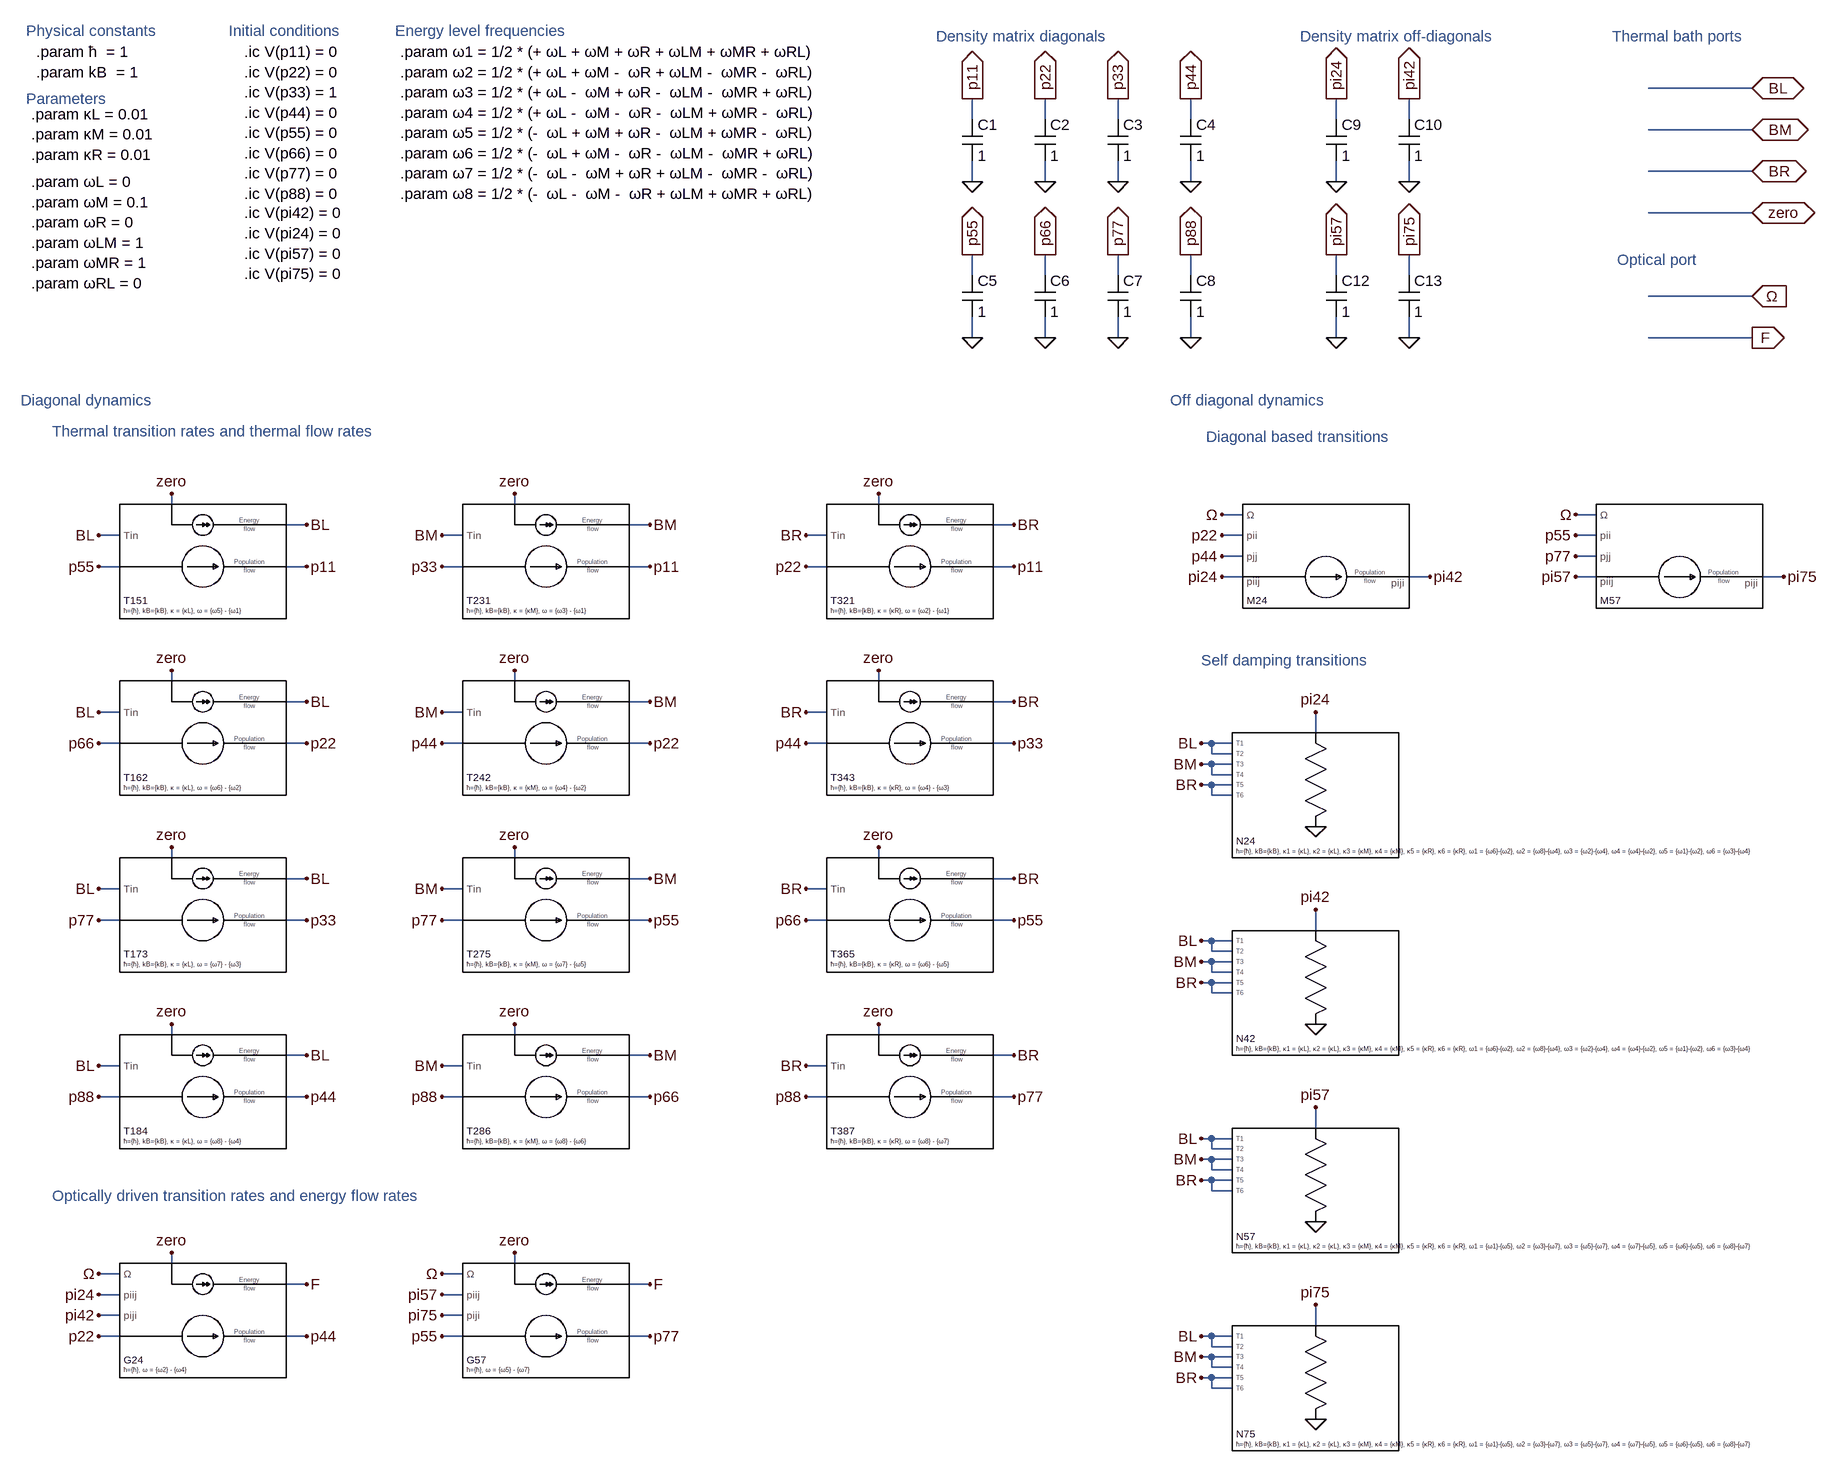
[diagram p0: schematic thermal_optical_gate_Wije.asc]
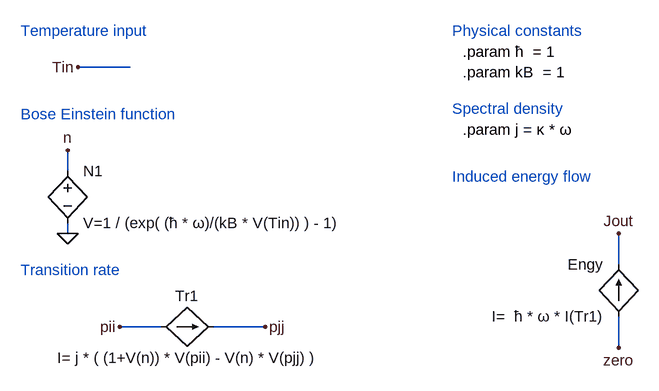
[diagram p1: sub-circuit transition_rate.asc]
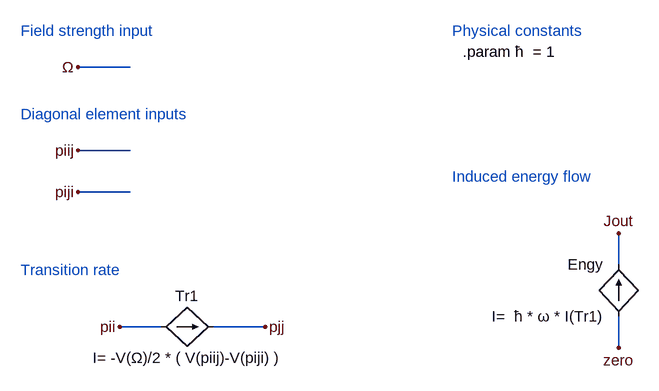
[diagram p2: sub-circuit driven_rate_diag.asc]
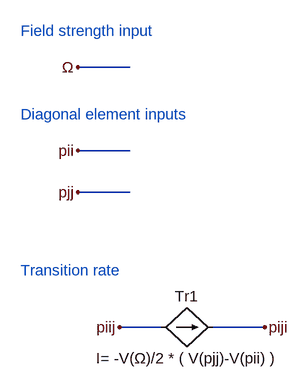
[diagram p3: sub-circuit driven_rate_ofdiag.asc]
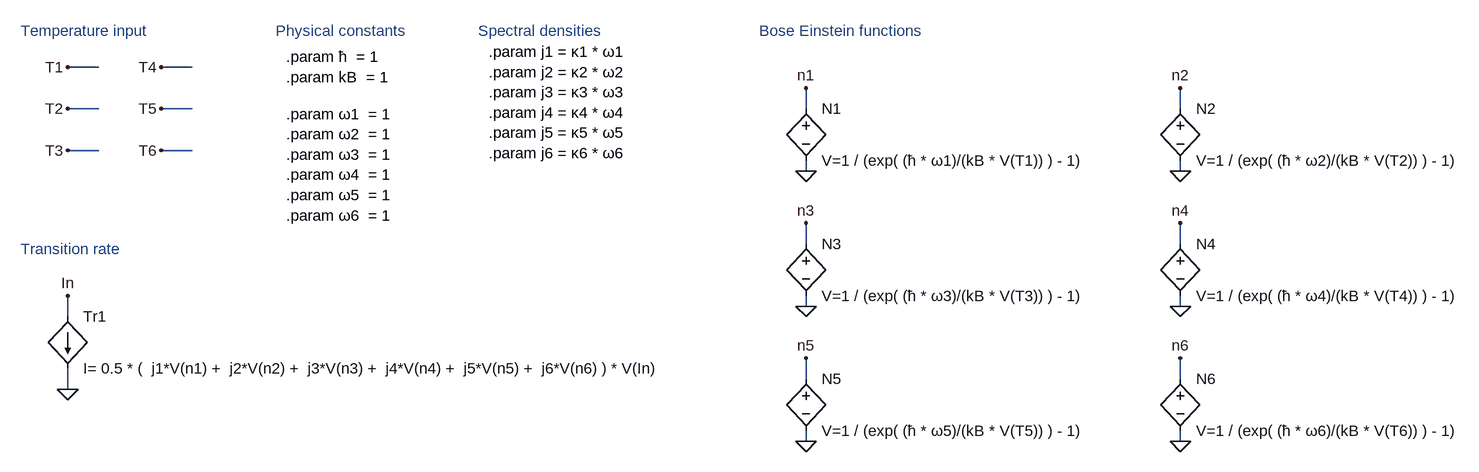
[diagram p4: sub-circuit self_damping_rate.asc]
thermal_optical_gate_Wije.asc, the LTspice schematic file:
Version 4
SHEET 1 2824 2404
WIRE 1968 96 1808 96
WIRE 768 144 768 112
WIRE 880 144 880 112
WIRE 992 144 992 112
WIRE 1104 144 1104 112
WIRE 1328 144 1328 112
WIRE 1440 144 1440 112
WIRE 1968 160 1808 160
WIRE 1968 224 1808 224
WIRE 768 240 768 208
WIRE 880 240 880 208
WIRE 992 240 992 208
WIRE 1104 240 1104 208
WIRE 1328 240 1328 208
WIRE 1440 240 1440 208
WIRE 1968 288 1808 288
WIRE 768 384 768 352
WIRE 880 384 880 352
WIRE 992 384 992 352
WIRE 1104 384 1104 352
WIRE 1328 384 1328 352
WIRE 1440 384 1440 352
WIRE 1968 416 1808 416
WIRE 768 480 768 448
WIRE 880 480 880 448
WIRE 992 480 992 448
WIRE 1104 480 1104 448
WIRE 1328 480 1328 448
WIRE 1440 480 1440 448
WIRE 1968 480 1808 480
WIRE -464 736 -464 720
WIRE 64 736 64 720
WIRE 624 736 624 720
WIRE 1184 752 1152 752
WIRE 1728 752 1696 752
WIRE -256 768 -288 768
WIRE 272 768 240 768
WIRE 832 768 800 768
WIRE -544 784 -576 784
WIRE -16 784 -48 784
WIRE 544 784 512 784
WIRE 1184 784 1152 784
WIRE 1728 784 1696 784
WIRE 1184 816 1152 816
WIRE 1728 816 1696 816
WIRE -544 832 -576 832
WIRE -256 832 -288 832
WIRE -16 832 -48 832
WIRE 272 832 240 832
WIRE 544 832 512 832
WIRE 832 832 800 832
WIRE 1184 848 1152 848
WIRE 1472 848 1440 848
WIRE 1728 848 1696 848
WIRE 2016 848 1984 848
WIRE -464 1008 -464 992
WIRE 64 1008 64 992
WIRE 624 1008 624 992
WIRE -256 1040 -288 1040
WIRE 272 1040 240 1040
WIRE 832 1040 800 1040
WIRE -544 1056 -576 1056
WIRE -16 1056 -48 1056
WIRE 544 1056 512 1056
WIRE 1296 1088 1296 1056
WIRE -544 1104 -576 1104
WIRE -256 1104 -288 1104
WIRE -16 1104 -48 1104
WIRE 272 1104 240 1104
WIRE 544 1104 512 1104
WIRE 832 1104 800 1104
WIRE 1136 1104 1120 1104
WIRE 1168 1104 1136 1104
WIRE 1136 1120 1136 1104
WIRE 1168 1120 1136 1120
WIRE 1136 1136 1120 1136
WIRE 1168 1136 1136 1136
WIRE 1136 1152 1136 1136
WIRE 1168 1152 1136 1152
WIRE 1136 1168 1120 1168
WIRE 1168 1168 1136 1168
WIRE 1136 1184 1136 1168
WIRE 1168 1184 1136 1184
WIRE -464 1280 -464 1264
WIRE 64 1280 64 1264
WIRE 624 1280 624 1264
WIRE -256 1312 -288 1312
WIRE 272 1312 240 1312
WIRE 832 1312 800 1312
WIRE -544 1328 -576 1328
WIRE -16 1328 -48 1328
WIRE 544 1328 512 1328
WIRE -544 1376 -576 1376
WIRE -256 1376 -288 1376
WIRE -16 1376 -48 1376
WIRE 272 1376 240 1376
WIRE 544 1376 512 1376
WIRE 832 1376 800 1376
WIRE 1296 1392 1296 1360
WIRE 1136 1408 1120 1408
WIRE 1168 1408 1136 1408
WIRE 1136 1424 1136 1408
WIRE 1168 1424 1136 1424
WIRE 1136 1440 1120 1440
WIRE 1168 1440 1136 1440
WIRE 1136 1456 1136 1440
WIRE 1168 1456 1136 1456
WIRE 1136 1472 1120 1472
WIRE 1168 1472 1136 1472
WIRE 1136 1488 1136 1472
WIRE 1168 1488 1136 1488
WIRE -464 1552 -464 1536
WIRE 64 1552 64 1536
WIRE 624 1552 624 1536
WIRE -256 1584 -288 1584
WIRE 272 1584 240 1584
WIRE 832 1584 800 1584
WIRE -544 1600 -576 1600
WIRE -16 1600 -48 1600
WIRE 544 1600 512 1600
WIRE -544 1648 -576 1648
WIRE -256 1648 -288 1648
WIRE -16 1648 -48 1648
WIRE 272 1648 240 1648
WIRE 544 1648 512 1648
WIRE 832 1648 800 1648
WIRE 1296 1696 1296 1664
WIRE 1136 1712 1120 1712
WIRE 1168 1712 1136 1712
WIRE 1136 1728 1136 1712
WIRE 1168 1728 1136 1728
WIRE 1136 1744 1120 1744
WIRE 1168 1744 1136 1744
WIRE 1136 1760 1136 1744
WIRE 1168 1760 1136 1760
WIRE 1136 1776 1120 1776
WIRE 1168 1776 1136 1776
WIRE 1136 1792 1136 1776
WIRE 1168 1792 1136 1792
WIRE -464 1904 -464 1888
WIRE 64 1904 64 1888
WIRE -544 1920 -576 1920
WIRE -16 1920 -48 1920
WIRE -256 1936 -288 1936
WIRE 272 1936 240 1936
WIRE -544 1952 -576 1952
WIRE -16 1952 -48 1952
WIRE -544 1984 -576 1984
WIRE -16 1984 -48 1984
WIRE 1296 2000 1296 1968
WIRE -544 2016 -576 2016
WIRE -256 2016 -288 2016
WIRE -16 2016 -48 2016
WIRE 272 2016 240 2016
WIRE 1136 2016 1120 2016
WIRE 1168 2016 1136 2016
WIRE 1136 2032 1136 2016
WIRE 1168 2032 1136 2032
WIRE 1136 2048 1120 2048
WIRE 1168 2048 1136 2048
WIRE 1136 2064 1136 2048
WIRE 1168 2064 1136 2064
WIRE 1136 2080 1120 2080
WIRE 1168 2080 1136 2080
WIRE 1136 2096 1136 2080
WIRE 1168 2096 1136 2096
FLAG 768 240 0
FLAG 768 112 p11
IOPIN 768 112 Out
FLAG 880 240 0
FLAG 880 112 p22
IOPIN 880 112 Out
FLAG 992 240 0
FLAG 992 112 p33
IOPIN 992 112 Out
FLAG 1104 240 0
FLAG 1104 112 p44
IOPIN 1104 112 Out
FLAG 768 480 0
FLAG 768 352 p55
IOPIN 768 352 Out
FLAG 880 480 0
FLAG 880 352 p66
IOPIN 880 352 Out
FLAG 992 480 0
FLAG 992 352 p77
IOPIN 992 352 Out
FLAG 1104 480 0
FLAG 1104 352 p88
IOPIN 1104 352 Out
FLAG -576 832 p55
FLAG -256 832 p11
FLAG -576 784 BL
FLAG -576 1104 p66
FLAG -256 1104 p22
FLAG -576 1056 BL
FLAG -576 1376 p77
FLAG -256 1376 p33
FLAG -576 1328 BL
FLAG -576 1648 p88
FLAG -256 1648 p44
FLAG -576 1600 BL
FLAG -48 832 p33
FLAG 272 832 p11
FLAG -48 784 BM
FLAG -48 1104 p44
FLAG 272 1104 p22
FLAG -48 1056 BM
FLAG -48 1376 p77
FLAG 272 1376 p55
FLAG -48 1328 BM
FLAG -48 1648 p88
FLAG 272 1648 p66
FLAG -48 1600 BM
FLAG 512 832 p22
FLAG 832 832 p11
FLAG 512 784 BR
FLAG 512 1104 p44
FLAG 832 1104 p33
FLAG 512 1056 BR
FLAG 512 1376 p66
FLAG 832 1376 p55
FLAG 512 1328 BR
FLAG 512 1648 p88
FLAG 832 1648 p77
FLAG 512 1600 BR
FLAG -256 768 BL
FLAG -256 1040 BL
FLAG -256 1312 BL
FLAG -256 1584 BL
FLAG 272 1584 BM
FLAG 272 1312 BM
FLAG 272 1040 BM
FLAG 272 768 BM
FLAG 832 1040 BR
FLAG 832 768 BR
FLAG 832 1312 BR
FLAG 832 1584 BR
FLAG 1968 96 BL
IOPIN 1968 96 BiDir
FLAG 1968 160 BM
IOPIN 1968 160 BiDir
FLAG 1968 224 BR
IOPIN 1968 224 BiDir
FLAG 1968 288 zero
IOPIN 1968 288 BiDir
FLAG 64 720 zero
FLAG -464 720 zero
FLAG -464 992 zero
FLAG 64 992 zero
FLAG 624 992 zero
FLAG 624 720 zero
FLAG 64 1264 zero
FLAG -464 1264 zero
FLAG 624 1264 zero
FLAG 64 1536 zero
FLAG -464 1536 zero
FLAG 624 1536 zero
FLAG 1968 416 Ω
IOPIN 1968 416 In
FLAG 1328 240 0
FLAG 1328 112 pi24
IOPIN 1328 112 Out
FLAG 1440 240 0
FLAG 1440 112 pi42
IOPIN 1440 112 Out
FLAG 1328 480 0
FLAG 1328 352 pi57
IOPIN 1328 352 Out
FLAG 1440 480 0
FLAG 1440 352 pi75
IOPIN 1440 352 Out
FLAG 1968 480 F
IOPIN 1968 480 Out
FLAG -464 1888 zero
FLAG 64 1888 zero
FLAG -576 1920 Ω
FLAG -48 1920 Ω
FLAG -576 2016 p22
FLAG -256 2016 p44
FLAG -48 2016 p55
FLAG 272 2016 p77
FLAG -256 1936 F
FLAG 272 1936 F
FLAG -576 1984 pi42
FLAG -576 1952 pi24
FLAG -48 1984 pi75
FLAG -48 1952 pi57
FLAG 1152 752 Ω
FLAG 1152 848 pi24
FLAG 1152 816 p44
FLAG 1152 784 p22
FLAG 1472 848 pi42
FLAG 2016 848 pi75
FLAG 1696 752 Ω
FLAG 1696 848 pi57
FLAG 1696 816 p77
FLAG 1696 784 p55
FLAG 1296 1056 pi24
FLAG 1120 1104 BL
FLAG 1120 1136 BM
FLAG 1120 1168 BR
FLAG 1296 1360 pi42
FLAG 1120 1408 BL
FLAG 1120 1440 BM
FLAG 1120 1472 BR
FLAG 1296 1664 pi57
FLAG 1120 1712 BL
FLAG 1120 1744 BM
FLAG 1120 1776 BR
FLAG 1296 1968 pi75
FLAG 1120 2016 BL
FLAG 1120 2048 BM
FLAG 1120 2080 BR
SYMBOL cap 752 144 R0
SYMATTR InstName C1
SYMATTR Value 1
SYMBOL cap 864 144 R0
SYMATTR InstName C2
SYMATTR Value 1
SYMBOL cap 976 144 R0
SYMATTR InstName C3
SYMATTR Value 1
SYMBOL cap 1088 144 R0
SYMATTR InstName C4
SYMATTR Value 1
SYMBOL cap 752 384 R0
SYMATTR InstName C5
SYMATTR Value 1
SYMBOL cap 864 384 R0
SYMATTR InstName C6
SYMATTR Value 1
SYMBOL cap 976 384 R0
SYMATTR InstName C7
SYMATTR Value 1
SYMBOL cap 1088 384 R0
SYMATTR InstName C8
SYMATTR Value 1
SYMBOL transition_rate -496 768 R0
SYMATTR SpiceLine ħ={ħ}, kB={kB}, κ = {κL}, ω = {ω5} - {ω1}
SYMATTR InstName T151
SYMBOL transition_rate -496 1040 R0
SYMATTR SpiceLine ħ={ħ}, kB={kB}, κ = {κL}, ω = {ω6} - {ω2}
SYMATTR InstName T162
SYMBOL transition_rate -496 1312 R0
SYMATTR SpiceLine ħ={ħ}, kB={kB}, κ = {κL}, ω = {ω7} - {ω3}
SYMATTR InstName T173
SYMBOL transition_rate -496 1584 R0
SYMATTR SpiceLine ħ={ħ}, kB={kB}, κ = {κL}, ω = {ω8} - {ω4}
SYMATTR InstName T184
SYMBOL transition_rate 32 768 R0
SYMATTR SpiceLine ħ={ħ}, kB={kB}, κ = {κM}, ω = {ω3} - {ω1}
SYMATTR InstName T231
SYMBOL transition_rate 32 1040 R0
SYMATTR SpiceLine ħ={ħ}, kB={kB}, κ = {κM}, ω = {ω4} - {ω2}
SYMATTR InstName T242
SYMBOL transition_rate 32 1312 R0
SYMATTR SpiceLine ħ={ħ}, kB={kB}, κ = {κM}, ω = {ω7} - {ω5}
SYMATTR InstName T275
SYMBOL transition_rate 32 1584 R0
SYMATTR SpiceLine ħ={ħ}, kB={kB}, κ = {κM}, ω = {ω8} - {ω6}
SYMATTR InstName T286
SYMBOL transition_rate 592 768 R0
SYMATTR SpiceLine ħ={ħ}, kB={kB}, κ = {κR}, ω = {ω2} - {ω1}
SYMATTR InstName T321
SYMBOL transition_rate 592 1040 R0
SYMATTR SpiceLine ħ={ħ}, kB={kB}, κ = {κR}, ω = {ω4} - {ω3}
SYMATTR InstName T343
SYMBOL transition_rate 592 1312 R0
SYMATTR SpiceLine ħ={ħ}, kB={kB}, κ = {κR}, ω = {ω6} - {ω5}
SYMATTR InstName T365
SYMBOL transition_rate 592 1584 R0
SYMATTR SpiceLine ħ={ħ}, kB={kB}, κ = {κR}, ω = {ω8} - {ω7}
SYMATTR InstName T387
SYMBOL cap 1312 144 R0
SYMATTR InstName C9
SYMATTR Value 1
SYMBOL cap 1424 144 R0
SYMATTR InstName C10
SYMATTR Value 1
SYMBOL cap 1312 384 R0
SYMATTR InstName C12
SYMATTR Value 1
SYMBOL cap 1424 384 R0
SYMATTR InstName C13
SYMATTR Value 1
SYMBOL driven_rate_diag -496 1936 R0
SYMATTR SpiceLine ħ={ħ}, ω = {ω2} - {ω4}
SYMATTR InstName G24
SYMBOL driven_rate_diag 32 1936 R0
SYMATTR SpiceLine ħ={ħ}, ω = {ω5} - {ω7}
SYMATTR InstName G57
SYMBOL driven_rate_ofdiag 1232 768 R0
SYMATTR InstName M24
SYMBOL driven_rate_ofdiag 1776 768 R0
SYMATTR InstName M57
SYMBOL self_damping_rate 1216 1120 R0
SYMATTR SpiceLine ħ={ħ}, kB={kB}, κ1 = {κL}, κ2 = {κL}, κ3 = {κM}, κ4 = {κM}, κ5 = {κR}, κ6 = {κR}, ω1 = {ω6}-{ω2}, ω2 = {ω8}-{ω4}, ω3 = {ω2}-{ω4}, ω4 = {ω4}-{ω2}, ω5 = {ω1}-{ω2}, ω6 = {ω3}-{ω4}
SYMATTR InstName N24
SYMBOL self_damping_rate 1216 1424 R0
SYMATTR SpiceLine ħ={ħ}, kB={kB}, κ1 = {κL}, κ2 = {κL}, κ3 = {κM}, κ4 = {κM}, κ5 = {κR}, κ6 = {κR}, ω1 = {ω6}-{ω2}, ω2 = {ω8}-{ω4}, ω3 = {ω2}-{ω4}, ω4 = {ω4}-{ω2}, ω5 = {ω1}-{ω2}, ω6 = {ω3}-{ω4}
SYMATTR InstName N42
SYMBOL self_damping_rate 1216 1728 R0
SYMATTR SpiceLine ħ={ħ}, kB={kB}, κ1 = {κL}, κ2 = {κL}, κ3 = {κM}, κ4 = {κM}, κ5 = {κR}, κ6 = {κR}, ω1 = {ω1}-{ω5}, ω2 = {ω3}-{ω7}, ω3 = {ω5}-{ω7}, ω4 = {ω7}-{ω5}, ω5 = {ω6}-{ω5}, ω6 = {ω8}-{ω7}
SYMATTR InstName N57
SYMBOL self_damping_rate 1216 2032 R0
SYMATTR SpiceLine ħ={ħ}, kB={kB}, κ1 = {κL}, κ2 = {κL}, κ3 = {κM}, κ4 = {κM}, κ5 = {κR}, κ6 = {κR}, ω1 = {ω1}-{ω5}, ω2 = {ω3}-{ω7}, ω3 = {ω5}-{ω7}, ω4 = {ω7}-{ω5}, ω5 = {ω6}-{ω5}, ω6 = {ω8}-{ω7}
SYMATTR InstName N75
TEXT -352 40 Left 2 !.ic V(p11) = 0\n.ic V(p22) = 0\n.ic V(p33) = 1\n.ic V(p44) = 0\n.ic V(p55) = 0\n.ic V(p66) = 0\n.ic V(p77) = 0\n.ic V(p88) = 0
TEXT -376 8 Left 2 ;Initial conditions
TEXT 712 16 Left 2 ;Density matrix diagonals
TEXT -648 624 Left 2 ;Thermal transition rates and thermal flow rates
TEXT -688 112 Left 2 ;Parameters
TEXT -680 136 Left 2 !.param κL = 0.01\n.param κM = 0.01\n.param κR = 0.01
TEXT -680 240 Left 2 !.param ωL = 0\n.param ωM = 0.1\n.param ωR = 0\n.param ωLM = 1\n.param ωMR = 1\n.param ωRL = 0
TEXT -672 40 Left 2 !.param ħ  = 1\n.param kB  = 1
TEXT -688 8 Left 2 ;Physical constants
TEXT -120 8 Left 2 ;Energy level frequencies
TEXT -112 40 Left 2 !.param ω1 = 1/2 * (+ ωL + ωM + ωR + ωLM + ωMR + ωRL)\n.param ω2 = 1/2 * (+ ωL + ωM -  ωR + ωLM -  ωMR -  ωRL)\n.param ω3 = 1/2 * (+ ωL -  ωM + ωR -  ωLM -  ωMR + ωRL)\n.param ω4 = 1/2 * (+ ωL -  ωM -  ωR -  ωLM + ωMR -  ωRL)\n.param ω5 = 1/2 * (-  ωL + ωM + ωR -  ωLM + ωMR -  ωRL)\n.param ω6 = 1/2 * (-  ωL + ωM -  ωR -  ωLM -  ωMR + ωRL)\n.param ω7 = 1/2 * (-  ωL -  ωM + ωR + ωLM -  ωMR -  ωRL)\n.param ω8 = 1/2 * (-  ωL -  ωM -  ωR + ωLM + ωMR + ωRL)
TEXT 1752 16 Left 2 ;Thermal bath ports
TEXT 1760 360 Left 2 ;Optical port
TEXT 1272 16 Left 2 ;Density matrix off-diagonals
TEXT -352 288 Left 2 !.ic V(pi42) = 0\n.ic V(pi24) = 0\n.ic V(pi57) = 0\n.ic V(pi75) = 0
TEXT -648 1800 Left 2 ;Optically driven transition rates and energy flow rates
TEXT -696 576 Left 2 ;Diagonal dynamics
TEXT 1072 576 Left 2 ;Off diagonal dynamics
TEXT 1128 632 Left 2 ;Diagonal based transitions
TEXT 1120 976 Left 2 ;Self damping transitions

transition_rate.asc, the sub-circuit schematic file:
Version 4
SHEET 1 880 680
WIRE -64 -96 -144 -96
WIRE -160 64 -160 32
WIRE -160 160 -160 144
WIRE 688 208 688 160
WIRE -16 304 -80 304
WIRE 144 304 64 304
WIRE 688 336 688 288
FLAG -160 160 0
FLAG -144 -96 Tin
FLAG -160 32 n
FLAG -80 304 pii
FLAG 144 304 pjj
FLAG 688 160 Jout
FLAG 688 336 zero
SYMBOL bv -160 48 R0
SYMATTR InstName N1
SYMATTR Value V=1 / (exp( (ħ * ω)/(kB * V(Tin)) ) - 1)
SYMBOL bi -16 304 R270
WINDOW 0 32 40 VTop 2
WINDOW 3 -32 40 VBottom 2
SYMATTR InstName Tr1
SYMATTR Value I= j * ( (1+V(n)) * V(pii) - V(n) * V(pjj) )
SYMBOL bi 688 288 R180
WINDOW 0 24 80 Left 2
WINDOW 3 24 0 Left 2
SYMATTR InstName Engy
SYMATTR Value I=  ħ * ω * I(Tr1)
TEXT -232 -24 Left 2 ;Bose Einstein function
TEXT -232 -152 Left 2 ;Temperature input
TEXT -232 216 Left 2 ;Transition rate
TEXT 432 -152 Left 2 ;Physical constants
TEXT 448 -120 Left 2 !.param ħ  = 1\n.param kB  = 1
TEXT 432 -32 Left 2 ;Spectral density
TEXT 448 0 Left 2 !.param j = κ * ω
TEXT 432 72 Left 2 ;Induced energy flow

driven_rate_diag.asc, the sub-circuit schematic file:
Version 4
SHEET 1 880 680
WIRE -64 -96 -144 -96
WIRE -64 32 -144 32
WIRE -64 96 -144 96
WIRE 688 208 688 160
WIRE -16 304 -80 304
WIRE 144 304 64 304
WIRE 688 336 688 288
FLAG -144 -96 Ω
FLAG -80 304 pii
FLAG 144 304 pjj
FLAG 688 160 Jout
FLAG 688 336 zero
FLAG -144 32 piij
FLAG -144 96 piji
SYMBOL bi -16 304 R270
WINDOW 0 32 40 VTop 2
WINDOW 3 -32 40 VBottom 2
SYMATTR InstName Tr1
SYMATTR Value I= -V(Ω)/2 * ( V(piij)-V(piji) )
SYMBOL bi 688 288 R180
WINDOW 0 24 80 Left 2
WINDOW 3 24 0 Left 2
SYMATTR InstName Engy
SYMATTR Value I=  ħ * ω * I(Tr1)
TEXT -232 -24 Left 2 ;Diagonal element inputs
TEXT -232 -152 Left 2 ;Field strength input
TEXT -232 216 Left 2 ;Transition rate
TEXT 432 -152 Left 2 ;Physical constants
TEXT 448 -120 Left 2 !.param ħ  = 1
TEXT 432 72 Left 2 ;Induced energy flow

driven_rate_ofdiag.asc, the sub-circuit schematic file:
Version 4
SHEET 1 880 680
WIRE -64 -96 -144 -96
WIRE -64 32 -144 32
WIRE -64 96 -144 96
WIRE -16 304 -80 304
WIRE 144 304 64 304
FLAG -144 -96 Ω
FLAG -80 304 piij
FLAG 144 304 piji
FLAG -144 32 pii
FLAG -144 96 pjj
SYMBOL bi -16 304 R270
WINDOW 0 32 40 VTop 2
WINDOW 3 -32 40 VBottom 2
SYMATTR InstName Tr1
SYMATTR Value I= -V(Ω)/2 * ( V(pjj)-V(pii) )
TEXT -232 -24 Left 2 ;Diagonal element inputs
TEXT -232 -152 Left 2 ;Field strength input
TEXT -232 216 Left 2 ;Transition rate

self_damping_rate.asc, the sub-circuit schematic file:
Version 4
SHEET 1 1868 680
WIRE -288 -416 -336 -416
WIRE -144 -416 -192 -416
WIRE -288 -352 -336 -352
WIRE -144 -352 -192 -352
WIRE 800 -352 800 -384
WIRE 1376 -352 1376 -384
WIRE -288 -288 -336 -288
WIRE -144 -288 -192 -288
WIRE 800 -256 800 -272
WIRE 1376 -256 1376 -272
WIRE 800 -144 800 -176
WIRE 1376 -144 1376 -176
WIRE 800 -48 800 -64
WIRE 1376 -48 1376 -64
WIRE -336 -32 -336 -64
WIRE 800 64 800 32
WIRE 1376 64 1376 32
WIRE -336 80 -336 48
WIRE 800 160 800 144
WIRE 1376 160 1376 144
FLAG 800 -256 0
FLAG -336 -416 T1
FLAG 800 -384 n1
FLAG -336 -64 In
FLAG -336 -352 T2
FLAG -336 -288 T3
FLAG -192 -416 T4
FLAG -192 -352 T5
FLAG -192 -288 T6
FLAG 1376 -256 0
FLAG 1376 -384 n2
FLAG 800 -48 0
FLAG 800 -176 n3
FLAG 1376 -48 0
FLAG 1376 -176 n4
FLAG 800 160 0
FLAG 800 32 n5
FLAG 1376 160 0
FLAG 1376 32 n6
FLAG -336 80 0
SYMBOL bv 800 -368 R0
SYMATTR InstName N1
SYMATTR Value V=1 / (exp( (ħ * ω1)/(kB * V(T1)) ) - 1)
SYMBOL bi -336 -32 R0
SYMATTR InstName Tr1
SYMATTR Value I= 0.5 * (  j1*V(n1) +  j2*V(n2) +  j3*V(n3) +  j4*V(n4) +  j5*V(n5) +  j6*V(n6) ) * V(In)
SYMBOL bv 1376 -368 R0
SYMATTR InstName N2
SYMATTR Value V=1 / (exp( (ħ * ω2)/(kB * V(T2)) ) - 1)
SYMBOL bv 800 -160 R0
SYMATTR InstName N3
SYMATTR Value V=1 / (exp( (ħ * ω3)/(kB * V(T3)) ) - 1)
SYMBOL bv 1376 -160 R0
SYMATTR InstName N4
SYMATTR Value V=1 / (exp( (ħ * ω4)/(kB * V(T4)) ) - 1)
SYMBOL bv 800 48 R0
SYMATTR InstName N5
SYMATTR Value V=1 / (exp( (ħ * ω5)/(kB * V(T5)) ) - 1)
SYMBOL bv 1376 48 R0
SYMATTR InstName N6
SYMATTR Value V=1 / (exp( (ħ * ω6)/(kB * V(T6)) ) - 1)
TEXT 728 -472 Left 2 ;Bose Einstein functions
TEXT -408 -472 Left 2 ;Temperature input
TEXT -408 -136 Left 2 ;Transition rate
TEXT -16 -472 Left 2 ;Physical constants
TEXT 0 -432 Left 2 !.param ħ  = 1\n.param kB  = 1
TEXT 296 -472 Left 2 ;Spectral densities
TEXT 312 -440 Left 2 !.param j1 = κ1 * ω1\n.param j2 = κ2 * ω2\n.param j3 = κ3 * ω3\n.param j4 = κ4 * ω4\n.param j5 = κ5 * ω5\n.param j6 = κ6 * ω6
TEXT 0 -344 Left 2 !.param ω1  = 1\n.param ω2  = 1\n.param ω3  = 1\n.param ω4  = 1\n.param ω5  = 1\n.param ω6  = 1

The netlist it stands for:
* thermal_optical_gate_Wije.asc
C1 p11 0 1
C2 p22 0 1
C3 p33 0 1
C4 p44 0 1
C5 p55 0 1
C6 p66 0 1
C7 p77 0 1
C8 p88 0 1
XT151 BL p55 p11 BL zero transition_rate params: ħ={ħ}, kB={kB}, κ = {κL}, ω = {ω5} - {ω1}
XT162 BL p66 p22 BL zero transition_rate params: ħ={ħ}, kB={kB}, κ = {κL}, ω = {ω6} - {ω2}
XT173 BL p77 p33 BL zero transition_rate params: ħ={ħ}, kB={kB}, κ = {κL}, ω = {ω7} - {ω3}
XT184 BL p88 p44 BL zero transition_rate params: ħ={ħ}, kB={kB}, κ = {κL}, ω = {ω8} - {ω4}
XT231 BM p33 p11 BM zero transition_rate params: ħ={ħ}, kB={kB}, κ = {κM}, ω = {ω3} - {ω1}
XT242 BM p44 p22 BM zero transition_rate params: ħ={ħ}, kB={kB}, κ = {κM}, ω = {ω4} - {ω2}
XT275 BM p77 p55 BM zero transition_rate params: ħ={ħ}, kB={kB}, κ = {κM}, ω = {ω7} - {ω5}
XT286 BM p88 p66 BM zero transition_rate params: ħ={ħ}, kB={kB}, κ = {κM}, ω = {ω8} - {ω6}
XT321 BR p22 p11 BR zero transition_rate params: ħ={ħ}, kB={kB}, κ = {κR}, ω = {ω2} - {ω1}
XT343 BR p44 p33 BR zero transition_rate params: ħ={ħ}, kB={kB}, κ = {κR}, ω = {ω4} - {ω3}
XT365 BR p66 p55 BR zero transition_rate params: ħ={ħ}, kB={kB}, κ = {κR}, ω = {ω6} - {ω5}
XT387 BR p88 p77 BR zero transition_rate params: ħ={ħ}, kB={kB}, κ = {κR}, ω = {ω8} - {ω7}
C9 pi24 0 1
C10 pi42 0 1
C12 pi57 0 1
C13 pi75 0 1
XG24 pi24 p22 p44 F zero pi42 Ω driven_rate_diag params: ħ={ħ}, ω = {ω2} - {ω4}
XG57 pi57 p55 p77 F zero pi75 Ω driven_rate_diag params: ħ={ħ}, ω = {ω5} - {ω7}
XM24 Ω p22 p44 pi24 pi42 driven_rate_ofdiag
XM57 Ω p55 p77 pi57 pi75 driven_rate_ofdiag
XN24 pi24 BL BL BM BM BR BR self_damping_rate params: ħ={ħ}, kB={kB}, κ1 = {κL}, κ2 = {κL}, κ3 = {κM}, κ4 = {κM}, κ5 = {κR}, κ6 = {κR}, ω1 = {ω6}-{ω2}, ω2 = {ω8}-{ω4}, ω3 = {ω2}-{ω4}, ω4 = {ω4}-{ω2}, ω5 = {ω1}-{ω2}, ω6 = {ω3}-{ω4}
XN42 pi42 BL BL BM BM BR BR self_damping_rate params: ħ={ħ}, kB={kB}, κ1 = {κL}, κ2 = {κL}, κ3 = {κM}, κ4 = {κM}, κ5 = {κR}, κ6 = {κR}, ω1 = {ω6}-{ω2}, ω2 = {ω8}-{ω4}, ω3 = {ω2}-{ω4}, ω4 = {ω4}-{ω2}, ω5 = {ω1}-{ω2}, ω6 = {ω3}-{ω4}
XN57 pi57 BL BL BM BM BR BR self_damping_rate params: ħ={ħ}, kB={kB}, κ1 = {κL}, κ2 = {κL}, κ3 = {κM}, κ4 = {κM}, κ5 = {κR}, κ6 = {κR}, ω1 = {ω1}-{ω5}, ω2 = {ω3}-{ω7}, ω3 = {ω5}-{ω7}, ω4 = {ω7}-{ω5}, ω5 = {ω6}-{ω5}, ω6 = {ω8}-{ω7}
XN75 pi75 BL BL BM BM BR BR self_damping_rate params: ħ={ħ}, kB={kB}, κ1 = {κL}, κ2 = {κL}, κ3 = {κM}, κ4 = {κM}, κ5 = {κR}, κ6 = {κR}, ω1 = {ω1}-{ω5}, ω2 = {ω3}-{ω7}, ω3 = {ω5}-{ω7}, ω4 = {ω7}-{ω5}, ω5 = {ω6}-{ω5}, ω6 = {ω8}-{ω7}

* block symbol definitions
.subckt transition_rate Tin pii pjj Jout zero
B§N1 n 0 V=1 / (exp( (ħ * ω)/(kB * V(Tin)) ) - 1)
B§Tr1 pii pjj I= j * ( (1+V(n)) * V(pii) - V(n) * V(pjj) )
B§Engy zero Jout I=  ħ * ω * I(Tr1)
* Bose Einstein function
* Temperature input
* Transition rate
* Physical constants
.param ħ  = 1
.param kB  = 1
* Spectral density
.param j = κ * ω
* Induced energy flow
.ends transition_rate

.subckt driven_rate_diag piij pii pjj Jout zero piji Ω
B§Tr1 pii pjj I= -V(Ω)/2 * ( V(piij)-V(piji) )
B§Engy zero Jout I=  ħ * ω * I(Tr1)
* Diagonal element inputs
* Field strength input
* Transition rate
* Physical constants
.param ħ  = 1
* Induced energy flow
.ends driven_rate_diag

.subckt driven_rate_ofdiag Ω pii pjj piij piji
B§Tr1 piij piji I= -V(Ω)/2 * ( V(pjj)-V(pii) )
* Diagonal element inputs
* Field strength input
* Transition rate
.ends driven_rate_ofdiag

.subckt self_damping_rate In T1 T2 T3 T4 T5 T6
B§N1 n1 0 V=1 / (exp( (ħ * ω1)/(kB * V(T1)) ) - 1)
B§Tr1 In 0 I= 0.5 * (  j1*V(n1) +  j2*V(n2) +  j3*V(n3) +  j4*V(n4) +  j5*V(n5) +  j6*V(n6) ) * V(In)
B§N2 n2 0 V=1 / (exp( (ħ * ω2)/(kB * V(T2)) ) - 1)
B§N3 n3 0 V=1 / (exp( (ħ * ω3)/(kB * V(T3)) ) - 1)
B§N4 n4 0 V=1 / (exp( (ħ * ω4)/(kB * V(T4)) ) - 1)
B§N5 n5 0 V=1 / (exp( (ħ * ω5)/(kB * V(T5)) ) - 1)
B§N6 n6 0 V=1 / (exp( (ħ * ω6)/(kB * V(T6)) ) - 1)
* Bose Einstein functions
* Temperature input
* Transition rate
* Physical constants
.param ħ  = 1
.param kB  = 1
* Spectral densities
.param j1 = κ1 * ω1
.param j2 = κ2 * ω2
.param j3 = κ3 * ω3
.param j4 = κ4 * ω4
.param j5 = κ5 * ω5
.param j6 = κ6 * ω6
.param ω1  = 1
.param ω2  = 1
.param ω3  = 1
.param ω4  = 1
.param ω5  = 1
.param ω6  = 1
.ends self_damping_rate

.ic V(p11) = 0
.ic V(p22) = 0
.ic V(p33) = 1
.ic V(p44) = 0
.ic V(p55) = 0
.ic V(p66) = 0
.ic V(p77) = 0
.ic V(p88) = 0
* Initial conditions
* Density matrix diagonals
* Thermal transition rates and thermal flow rates
* Parameters
.param κL = 0.01
.param κM = 0.01
.param κR = 0.01
.param ωL = 0
.param ωM = 0.1
.param ωR = 0
.param ωLM = 1
.param ωMR = 1
.param ωRL = 0
.param ħ  = 1
.param kB  = 1
* Physical constants
* Energy level frequencies
.param ω1 = 1/2 * (+ ωL + ωM + ωR + ωLM + ωMR + ωRL)
.param ω2 = 1/2 * (+ ωL + ωM -  ωR + ωLM -  ωMR -  ωRL)
.param ω3 = 1/2 * (+ ωL -  ωM + ωR -  ωLM -  ωMR + ωRL)
.param ω4 = 1/2 * (+ ωL -  ωM -  ωR -  ωLM + ωMR -  ωRL)
.param ω5 = 1/2 * (-  ωL + ωM + ωR -  ωLM + ωMR -  ωRL)
.param ω6 = 1/2 * (-  ωL + ωM -  ωR -  ωLM -  ωMR + ωRL)
.param ω7 = 1/2 * (-  ωL -  ωM + ωR + ωLM -  ωMR -  ωRL)
.param ω8 = 1/2 * (-  ωL -  ωM -  ωR + ωLM + ωMR + ωRL)
* Thermal bath ports
* Optical port
* Density matrix off-diagonals
.ic V(pi42) = 0
.ic V(pi24) = 0
.ic V(pi57) = 0
.ic V(pi75) = 0
* Optically driven transition rates and energy flow rates
* Diagonal dynamics
* Off diagonal dynamics
* Diagonal based transitions
* Self damping transitions
.backanno
.end